# EAGLE schematic 4layer (EAGLE 7.6.0)
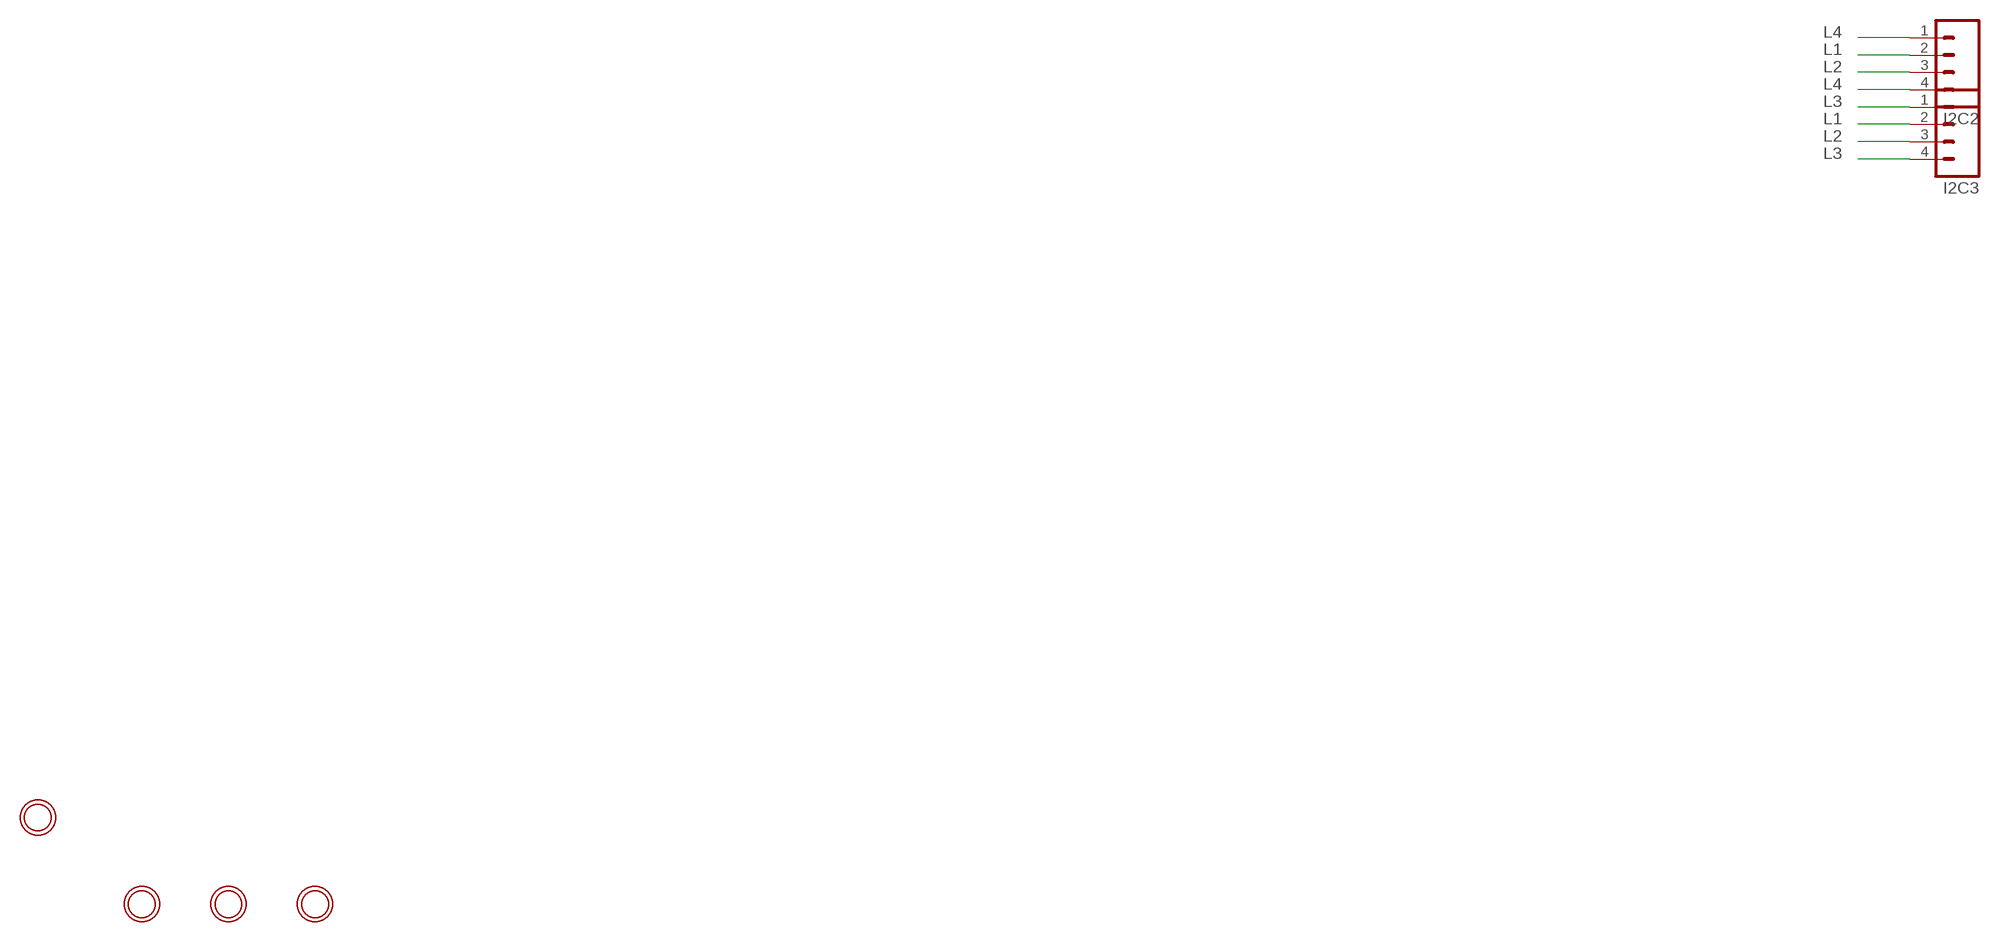
[diagram p0: schematic, sheet 1]

## Parts
I2C2  M04PTH  [1X04]
I2C3  M04PTH  [1X04]
U$1  MOUNTINGHOLE2.0  [MOUNTINGHOLE_2.0_PLATED]
U$2  MOUNTINGHOLE2.0  [MOUNTINGHOLE_2.0_PLATED]
U$3  MOUNTINGHOLE2.0  [MOUNTINGHOLE_2.0_PLATED]
U$7  MOUNTINGHOLE2.0  [MOUNTINGHOLE_2.0_PLATED]

## Nets
L1: I2C2.2 I2C3.2
L2: I2C2.3 I2C3.3
L3: I2C3.1 I2C3.4
L4: I2C2.1 I2C2.4

## Library data of the parts
I2C2 I2C3 = SparkFun:M04: Header 4 Standard 4-pin 0.1" header. Use with straight break away headers (SKU : PRT-00116), right angle break away headers (PRT-00553), swiss pins (PRT-00743), machine pins (PRT-00117), and female headers (PRT-00115). Molex polarized connector foot print use with SKU : PRT-08231 with associated crimp pins and housings.
U$1-U$3 U$7 = microbuilder:MOUNTINGHOLE: Mounting Hole For #2 screws (0.086"/2.18mm width, 0.094"/2.4mm hole) use 2.5mm; BOM: EXCLUDE

## Net classes
0 default: width 0.381 mm, drill 0.381 mm, clearance 0.305 mm
1 GND: width 0.508 mm, drill 0.381 mm, clearance 0.305 mm
2 pwr: width 0.508 mm, drill 0.381 mm, clearance 0.305 mm